# EAGLE design receiver (EAGLE 8.4.1)
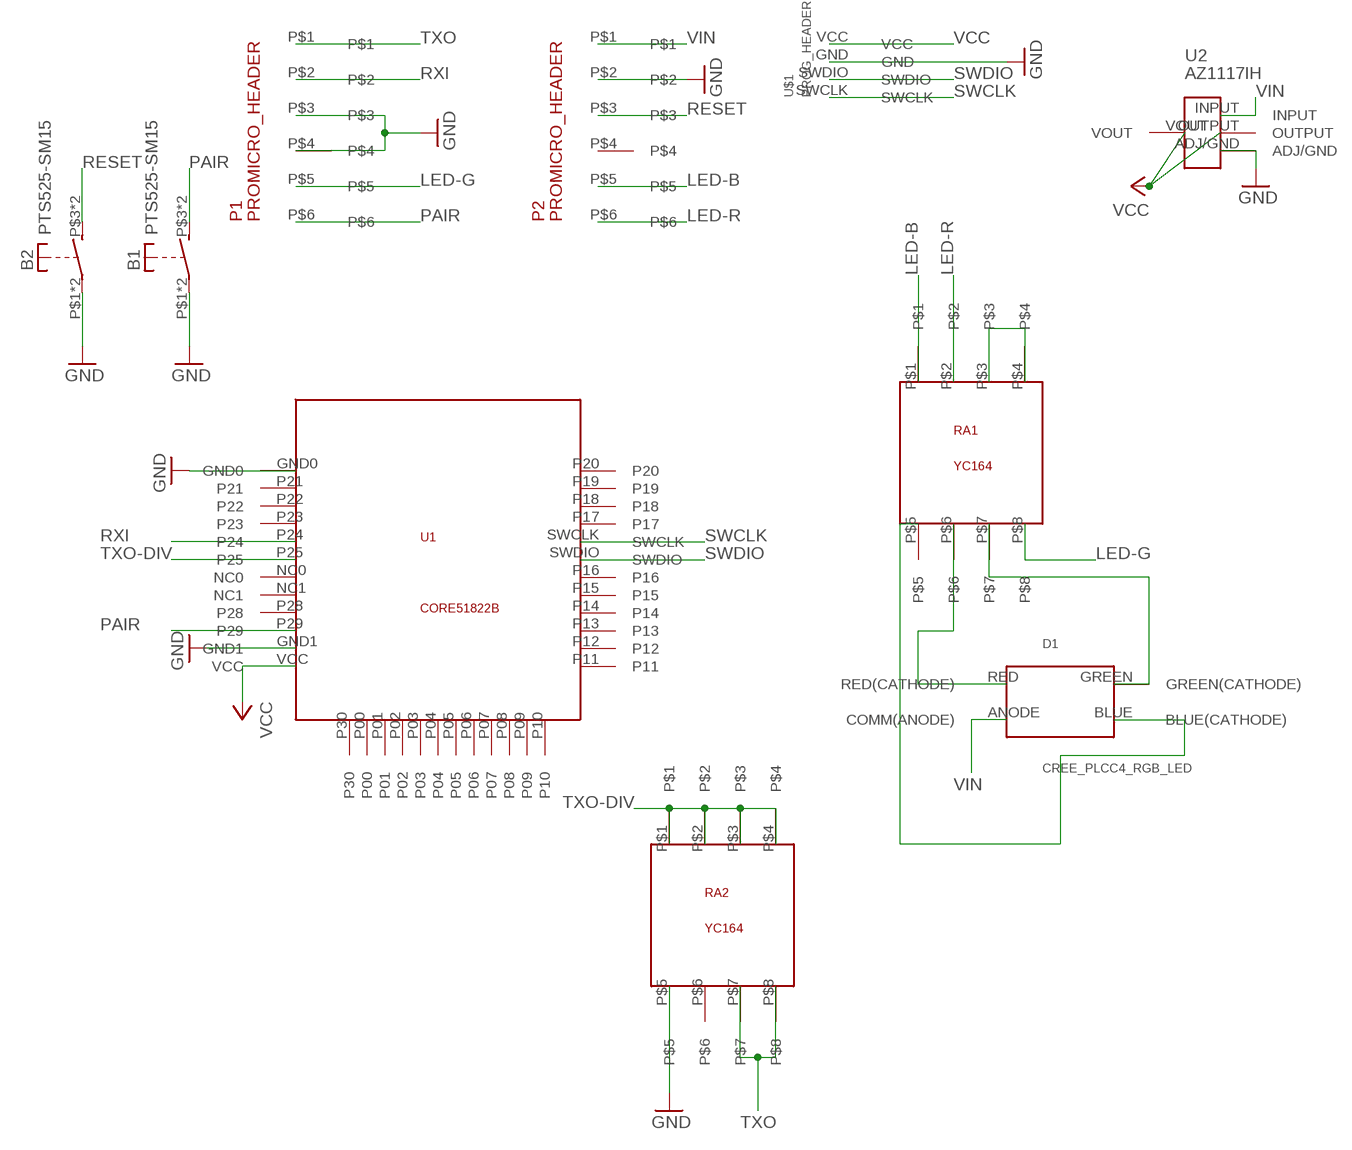
[diagram p0: schematic, sheet 1]

## Parts
B1  PTS525-SM15  [PTS525-SM15]
B2  PTS525-SM15  [PTS525-SM15]
D1  CREE_PLCC4_RGB_LED  [4-PLCC]
P1  PROMICRO_HEADER  [PROMICRO_HEADER]
P2  PROMICRO_HEADER  [PROMICRO_HEADER]
RA1  YC164  [YC164]
RA2  YC164  [YC164]
U1  CORE51822B  [CORE51822B]
U2  AZ1117IH  [AZ1117IH]
U$1  PROG_HEADER  [PROG_HEADER]

## Nets
GND: B1.P$1(P) B1.P$2(P) B2.P$1(P) B2.P$2(P) P1.P$3 P1.P$4 P2.P$2 RA2.P$5 U1.GND0 U1.GND1 U2.ADJ/GND U$1.GND
LED-B: P2.P$5 RA1.P$1
LED-G: P1.P$5 RA1.P$8
LED-R: P2.P$6 RA1.P$2
N$2: RA1.P$3 RA1.P$4
N$10: D1.GREEN(GREEN(CATHODE)) RA1.P$7
N$11: D1.RED(RED(CATHODE)) RA1.P$6
N$14: D1.BLUE(BLUE(CATHODE)) RA1.P$5
PAIR: B1.P$3(S) B1.P$4(S) P1.P$6 U1.P29
RESET: B2.P$3(S) B2.P$4(S) P2.P$3
RXI: P1.P$2 U1.P24
SWCLK: U1.SWCLK U$1.SWCLK
SWDIO: U1.SWDIO U$1.SWDIO
TXO: P1.P$1 RA2.P$7 RA2.P$8
TXO-DIV: RA2.P$1 RA2.P$2 RA2.P$3 RA2.P$4 U1.P25
VCC: U1.VCC U2.OUTPUT U2.VOUT U$1.VCC
VIN: D1.ANODE(COMM(ANODE)) P2.P$1 U2.INPUT
Unconnected: P2.P$4 RA2.P$6 U1.NC0 U1.NC1 U1.P00 U1.P01 U1.P02 U1.P03 U1.P04 U1.P05 U1.P06 U1.P07 U1.P08 U1.P09 U1.P10 U1.P11 U1.P12 U1.P13 U1.P14 U1.P15 U1.P16 U1.P17 U1.P18 U1.P19 U1.P20 U1.P21 U1.P22 U1.P23 U1.P28 U1.P30

## Library data of the parts
B1 B2 = pts525-sm15:PTS525-SM15
D1 = cree_plcc4_rgb_led:CREE_PLCC4_RGB_LED: Cree®PLCC4 3 in 1 SMD LED CLVBA-FKA
P1 P2 = promicro_header:PROMICRO_HEADER
RA1 RA2 = yc164:YC164
U1 = core51822b:CORE51822B: Core51822-b nRF51822 PCB
U2 = az1117ih:AZ1117IH
U$1 = prog_header:PROG_HEADER

## Net classes
0 default: width 0.305 mm, drill 0.254 mm, clearance 0.254 mm

## Board
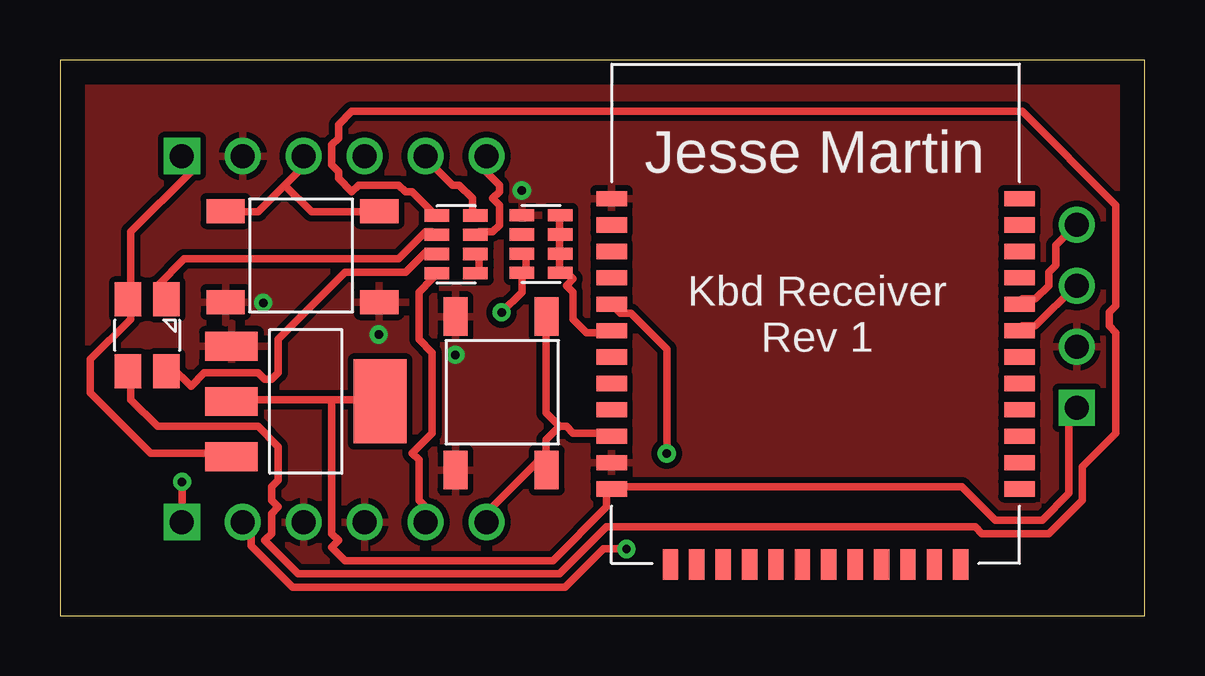
[diagram p1: board, top side]
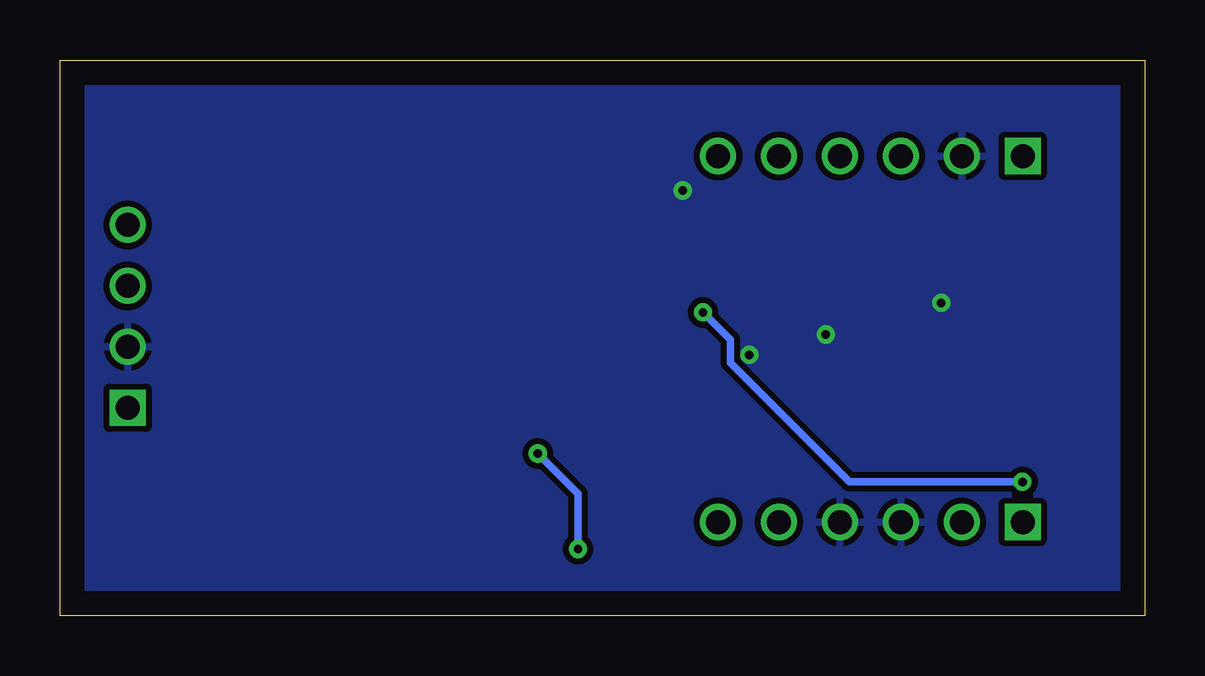
[diagram p2: board, bottom side, seen from below]

Size 45.21 x 23.15 mm. Coordinates in mm from the lower left corner, seen from the top.
Outline: 0,0 45.21,0 45.21,23.15 0,23.15 0,0
Copper layers (1*16): Top 0.035mm / dielectric 1.5mm / Bottom 0.035mm
Design rules "default": minimum track width 6mil, minimum drill 0.35mm, track to track 6mil, track to pad 6mil, pad to pad 6mil, via to via 6mil, smd to smd 6mil, copper to edge 40mil, drill to drill 6mil, minimum pad ring 10mil, minimum via ring 8mil, stop-mask expansion 4mil, vias tented up to drill 0mil, thermal gap 10mil

### Footprints (pad centres in the part's own frame; a part is rotated, then mirrored left to right if it is on the bottom)
PTS525-SM15 = smd 1.6 x 1: P$1 -3.2,1.9; P$2 3.2,1.9; P$3 -3.2,-1.9; P$4 3.2,-1.9
4-PLCC = smd 1.4 x 1.1: ANODE -1.5,-0.8; BLUE 1.5,-0.8; GREEN 1.5,0.8; RED -1.5,0.8
PROMICRO_HEADER = drill 1 square: P$1 0,6.35 | drill 1: P$2 0,3.81; P$3 0,1.27; P$4 0,-1.27; P$5 0,-3.81; P$6 0,-6.35
YC164 = smd 0.508 x 1.016: P$1 -1.2,0.8; P$2 -0.4,0.8; P$3 0.4,0.8; P$4 1.2,0.8; P$5 -1.2,-0.8; P$6 -0.4,-0.8; P$7 0.4,-0.8; P$8 1.2,-0.8
CORE51822B = smd 1.27 x 0.635: GND0 -8.5,4.8; GND1 -8.5,-6.2; NC0 -8.5,-1.8; NC1 -8.5,-2.9; P11 8.5,-7.3; P12 8.5,-6.2; P13 8.5,-5.1; P14 8.5,-4; P15 8.5,-2.9; P16 8.5,-1.8; P17 8.5,1.5; P18 8.5,2.6; P19 8.5,3.7; P20 8.5,4.8; P21 -8.5,3.7; P22 -8.5,2.6; P23 -8.5,1.5; P24 -8.5,0.4; P25 -8.5,-0.7; P28 -8.5,-4; P29 -8.5,-5.1; SWCLK 8.5,0.4; SWDIO 8.5,-0.7; VCC -8.5,-7.3 | smd 0.635 x 1.27: P00 -4.95,-10.45; P01 -3.85,-10.45; P02 -2.75,-10.45; P03 -1.65,-10.45; P04 -0.55,-10.45; P05 0.55,-10.45; P06 1.65,-10.45; P07 2.75,-10.45; P08 3.85,-10.45; P09 4.95,-10.45; P10 6.05,-10.45; P30 -6.05,-10.45
AZ1117IH = smd 1.2 x 2.2: ADJ/GND -2.3,-3.1; INPUT 2.3,-3.1; OUTPUT 0,-3.1 | smd 3.5 x 2.2: VOUT 0,3.1
PROG_HEADER = drill 1: GND 0,-2.54; SWCLK 0,-7.62; SWDIO 0,-5.08 | drill 1 square: VCC 0,0

### Placement (x,y rotation side)
B1  18.38,9.26 90 top
B2  10.1,14.96 180 top
D1  3.64,11.68 270 top
P1  11.43,3.9 90 top
P2  11.43,19.15 90 top
RA1  16.52,15.47 270 top
RA2  20.06,15.48 270 top
U1  31.5,12.57 0 top
U2  10.25,8.92 270 top
U$1  42.39,8.66 180 top

### Tracks (layer width: path | path; a pad name or v marks a point on that pad's centre or on a via)
GND  (via drill 0.35)
  other vias: 16.48,10.87 13.29,11.71 8.47,13.03 19.25,17.71
  pour Top: 0,24.19 45.72,24.19 45.72,0.19 0,0.19
  pour Bottom: -0.04,24.15 -0.04,0.11 45.66,0.11 45.66,24.25 0.06,24.25
LED-B
  Top 0.305: RA1.P$1 17.2,16.82 17.2,17.38 16.64,17.94 16.36,17.94 15.24,19.06 P2.P$5
LED-G
  Top 0.305: P1.P$5 15.24,4.53 14.96,4.81 14.96,6.49 14.68,6.77 15.52,7.6 15.52,10.96 14.96,11.52 14.96,13.47 15.52,14.03 RA1.P$8
LED-R
  Top 0.305: RA1.P$2 17.48,15.99 18.03,15.99 18.31,16.27 18.31,17.1 18.03,17.38 18.31,17.66 18.31,17.94 17.76,18.5 17.76,19.06 P2.P$6
N$2
  Top 0.305: RA1.P$4 17.48,14.31 17.48,14.87 RA1.P$3
N$10
  Top 0.305: RA1.P$7 15.52,15.15 15.24,15.15 14.4,14.31 11.89,14.31 9.09,11.52 9.09,10.12 8.81,9.84 8.53,9.84 8.26,10.12 6.02,10.12 5.46,9.56 4.62,10.4 D1.GREEN
N$11
  Top 0.305: RA1.P$6 15.52,15.99 15.24,15.99 14.12,14.87 5.18,14.87 4.06,13.75 4.06,13.47 4.34,13.19 D1.RED
N$14
  Top 0.305: RA1.P$5 15.52,16.82 14.68,17.66 14.4,17.66 14.12,17.94 12.45,17.94 12.17,17.66 11.61,18.22 11.61,18.5 11.33,18.78 11.33,19.62 11.61,19.9 11.61,20.46 12.17,21.02 40.11,21.02 44.02,17.1 44.02,12.91 43.74,12.63 43.74,12.07 44.02,11.8 44.02,7.6 42.62,6.21 42.62,4.81 41.22,3.41 38.43,3.41 38.15,3.69 22.78,3.69 20.83,1.74 9.93,1.74 8.53,3.13 8.81,3.41 8.81,4.25 9.09,4.53 8.81,4.81 8.81,5.37 9.09,5.65 9.09,7.05 8.26,7.88 4.06,7.88 2.95,9 2.95,10.12 D1.BLUE
PAIR
  Top 0.305: 20.83,7.88 21.11,7.88 21.39,7.6 22.78,7.6 U1.P29 | 20.83,7.88 20.27,7.32 20.27,6.77 | 20.27,6.77 20.27,6.21 B1.P$3 20.27,6.77 | 20.83,7.88 20.27,8.44 20.27,12.35 B1.P$4 | 20.27,6.77 18.03,4.53 18.03,3.97 P1.P$6
RESET
  Top 0.305: 9.37,17.94 9.93,18.5 9.93,19.06 P2.P$3 | 9.37,17.94 8.26,16.82 7.14,16.82 B2.P$4 | 9.37,17.94 10.49,16.82 13.28,16.82 B2.P$3
RXI  (via drill 0.35)
  Top 0.305: U1.P24 23.37,12.6 23.8,12.6 25.29,11.1 v25.29,6.75 | v23.62,2.78 22.66,2.78 21.06,1.18 9.7,1.18 7.98,2.9 7.98,3.54 P1.P$2
  Bottom 0.305: v23.62,2.78 23.62,5.08 v25.29,6.75
SWCLK
  Top 0.305: U1.SWCLK 40.11,13.19 40.67,13.19 41.22,13.75 41.22,14.31 41.5,14.59 41.5,15.43 42.34,16.27 U$1.SWCLK
SWDIO
  Top 0.305: U1.SWDIO 40.11,12.07 40.67,12.07 42.34,13.75 U$1.SWDIO
TXO  (via drill 0.35)
  Top 0.305: RA2.P$7 19.43,14.87 19.43,14.31 RA2.P$8 19.26,13.48 v18.41,12.64 | P1.P$1 5.09,3.91 v5.09,5.57
  Bottom 0.305: v18.41,12.64 17.26,11.49 17.26,10.54 12.29,5.57 v5.09,5.57
TXO-DIV
  Top 0.305: RA2.P$1 20.83,16.55 20.83,15.99 RA2.P$2 20.83,15.71 20.83,15.15 RA2.P$3 20.83,14.87 20.83,14.31 RA2.P$4 21.11,14.31 21.39,14.03 21.11,13.75 21.39,13.47 21.39,12.35 21.95,11.8 22.78,11.8 U1.P25
VCC
  Top 0.305: 11.33,9 13.28,9 U2.VOUT | 11.33,9 7.42,9 U2.OUTPUT | U$1.VCC 42.34,8.44 42.06,8.16 42.06,5.09 40.94,3.97 38.99,3.97 37.59,5.37 23.06,5.37 U1.VCC 22.78,5.09 22.78,4.53 20.55,2.3 11.89,2.3 11.33,2.85 11.61,3.13 11.33,3.41 11.33,9
VIN
  Top 0.305: P2.P$1 5.18,19.06 5.46,18.78 5.46,18.5 2.95,15.99 2.95,13.19 D1.ANODE 2.95,12.91 2.95,12.35 1.27,10.68 1.27,9.28 3.78,6.77 7.14,6.77 U2.INPUT

### Text on the board
tNames: Jesse Martin | Kbd Receiver / Rev 1